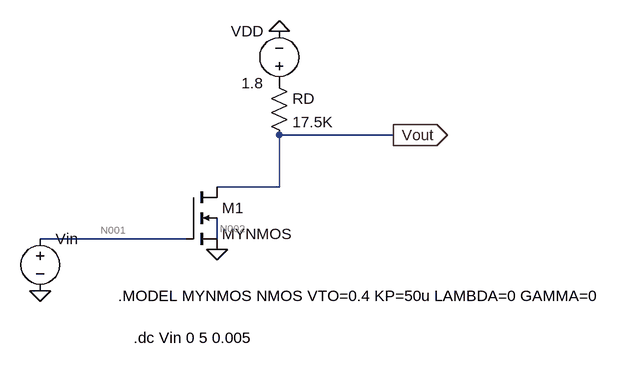
[diagram p0: schematic #3a.asc]
#3a.asc, the LTspice schematic file:
Version 4
SHEET 1 880 680
WIRE 336 176 160 176
WIRE 160 256 160 176
WIRE 160 256 64 256
WIRE 16 336 -208 336
WIRE 64 336 64 304
FLAG 160 16 0
FLAG 336 176 Vout
IOPIN 336 176 Out
FLAG 64 352 0
FLAG -208 416 0
SYMBOL res 144 80 R0
SYMATTR InstName RD
SYMATTR Value 17.5K
SYMBOL voltage 160 112 R180
WINDOW 0 24 96 Left 2
WINDOW 3 24 16 Left 2
SYMATTR InstName VDD
SYMATTR Value 1.8
SYMBOL voltage -208 320 R0
SYMATTR InstName Vin
SYMATTR Value ""
SYMBOL nmos4 16 256 R0
SYMATTR InstName M1
SYMATTR Value MYNMOS
TEXT -88 424 Left 2 !.MODEL MYNMOS NMOS VTO=0.4 KP=50u LAMBDA=0 GAMMA=0
TEXT -64 488 Left 2 !.dc Vin 0 5 0.005

The netlist it stands for:
* #3a.asc
RD P001 Vout 17.5K
VDD P001 0 1.8
Vin N001 0
M1 Vout N001 0 N002 MYNMOS
.model NMOS NMOS
.model PMOS PMOS
.lib standard.mos
.MODEL MYNMOS NMOS VTO=0.4 KP=50u LAMBDA=0 GAMMA=0
.dc Vin 0 5 0.005
.backanno
.end

* Results of the author's LTspice run, read from the files saved beside the schematic
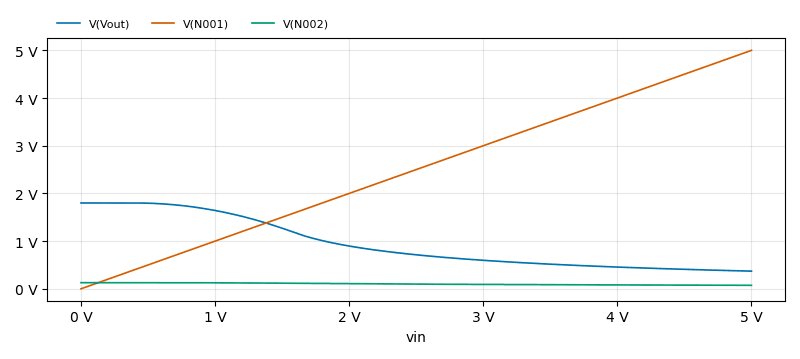
[diagram p1: DC transfer characteristic of #3a.asc, plotted from the saved traces]
* DC transfer characteristic, 1 run:
*   V(Vout): 1.8 V at vin=0 V, 370.1 mV at vin=5 V, min 370.1 mV, max 1.8 V
*   V(N001): 0 V at vin=0 V, 5 V at vin=5 V, min 0 V, max 5 V
*   V(N002): 128.4 mV at vin=0 V, 73.31 mV at vin=5 V, min 73.31 mV, max 128.4 mV